# EAGLE design ReflowController (EAGLE 9.6.1)
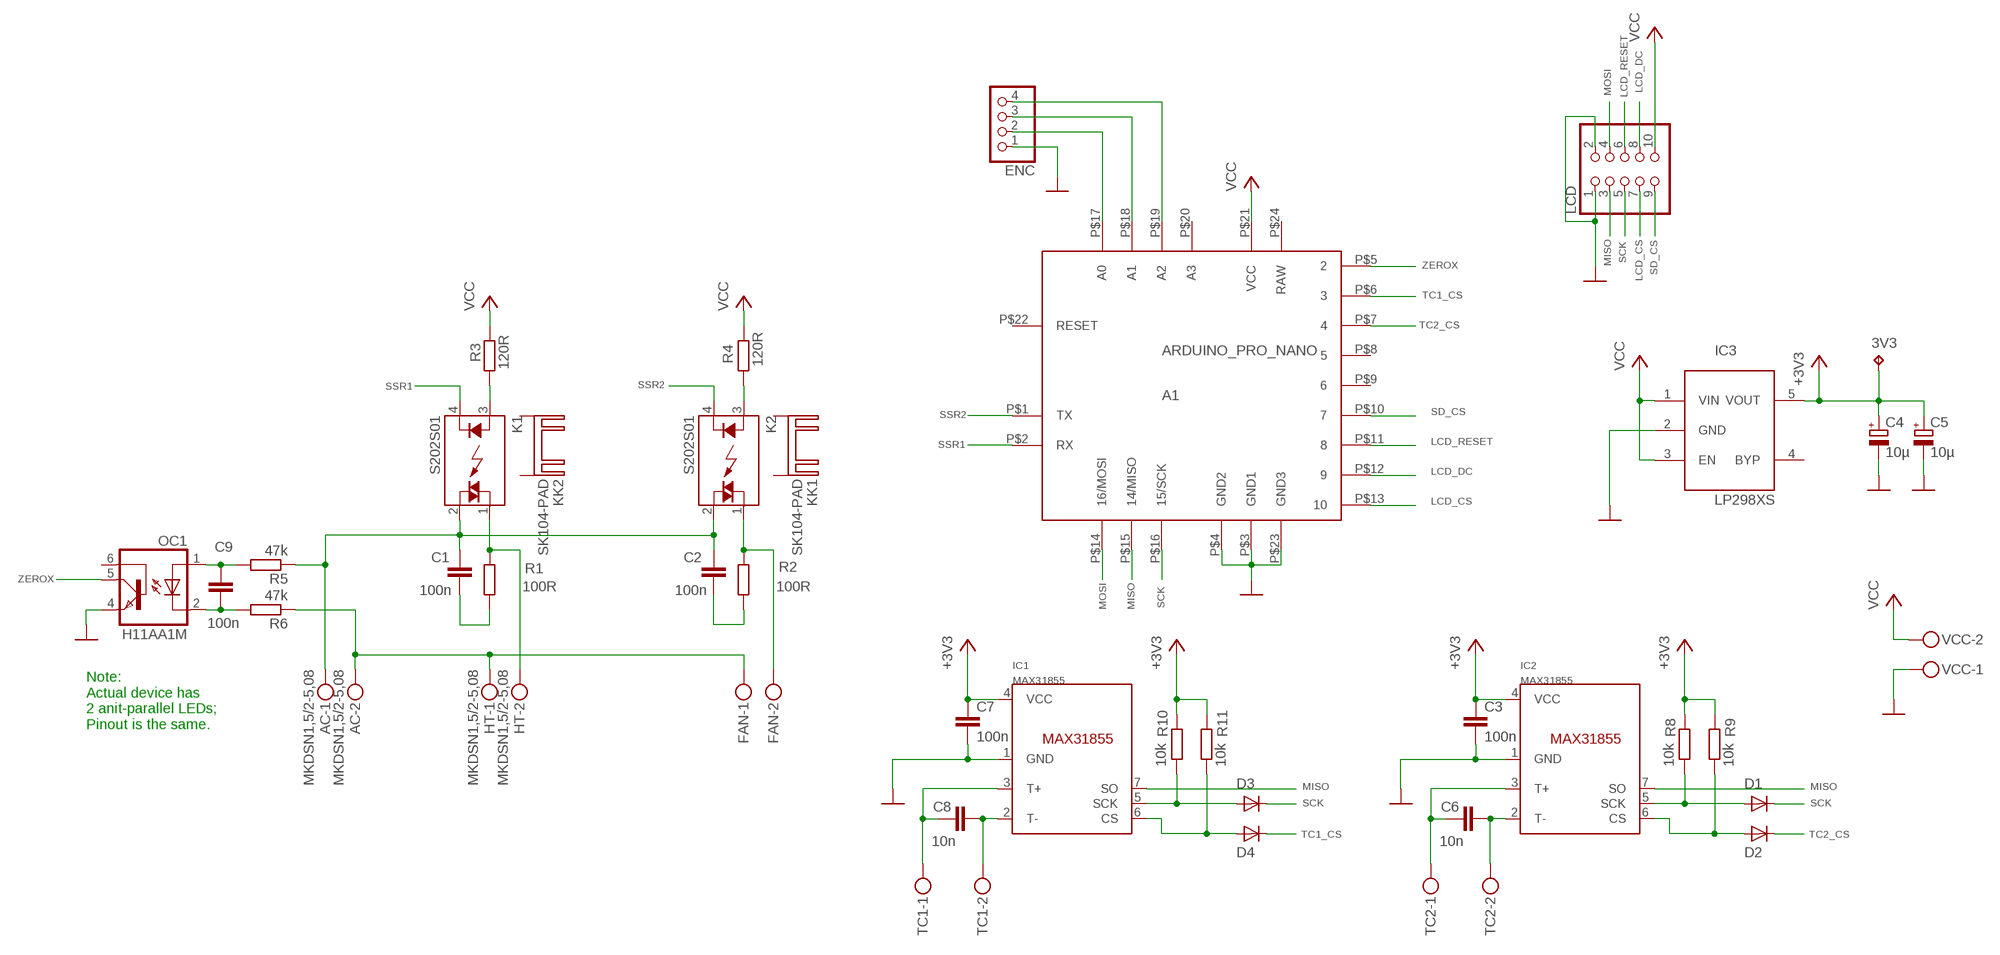
[diagram p0: schematic, sheet 1]

## Parts
3V3  TPTP08R  [TP08R]
A1  ARDUINO_PRO_NANO  [ARDUINO_PRO_NANO]
AC  MKDSN1,5/2-5,08  [MKDSN1,5/2-5,08]
C1  100n  CXXC10B5  [XC10B5]
C2  100n  CXXC10B5  [XC10B5]
C3  100n  C-EUC0805  [C0805]
C4  10µ  CPOL-EUC/6032-28R  [C/6032-28R]
C5  10µ  CPOL-EUC/6032-28R  [C/6032-28R]
C6  10n  C-EUC0603  [C0603]
C7  100n  C-EUC0805  [C0805]
C8  10n  C-EUC0603  [C0603]
C9  100n  C-EU025-025X050  [C025-025X050]
D1  DIODESOD-123  [SOD-123]
D2  DIODESOD-123  [SOD-123]
D3  DIODESOD-123  [SOD-123]
D4  DIODESOD-123  [SOD-123]
ENC  PINHD-1X4  [1X04]
FAN  MKDSN1,5/2-5,08  [MKDSN1,5/2-5,08]
HT  MKDSN1,5/2-5,08  [MKDSN1,5/2-5,08]
IC1  MAX31855  [SOIC8]
IC2  MAX31855  [SOIC8]
IC3  LP298XS  [SOT23-5L]
K1  S202S01  [S102S01]
K2  S202S01  [S102S01]
KK1  SK104-PAD  [SK104-PAD]
KK2  SK104-PAD  [SK104-PAD]
LCD  PINHD-2X5  [2X05]
OC1  H11AA1M  H11A1M  [DIL06]
R1  100R  R-EU_0207/5V  [0207/5V]
R2  100R  R-EU_0207/5V  [0207/5V]
R3  120R  R-EU_R0603  [R0603]
R4  120R  R-EU_R0603  [R0603]
R5  47k  R-EU_0207/5V  [0207/5V]
R6  47k  R-EU_0207/5V  [0207/5V]
R8  10k  R-EU_R0603  [R0603]
R9  10k  R-EU_R0603  [R0603]
R10  10k  R-EU_R0603  [R0603]
R11  10k  R-EU_R0603  [R0603]
TC1  MKDSN1,5/2-5,08  [MKDSN1,5/2-5,08]
TC2  MKDSN1,5/2-5,08  [MKDSN1,5/2-5,08]
VCC  MKDSN1,5/2-5,08  [MKDSN1,5/2-5,08]

## Nets
+3V3: 3V3.TP C3.1 C4.+ C5.+ C7.1 IC1.4(VCC) IC2.4(VCC) IC3.5(VOUT) R8.2 R9.2 R10.2 R11.2
AC1: AC.1 C1.1 C2.1 K1.2(DS2) K2.2(DS2) R5.1
AC2: AC.2 FAN.1 HT.1 R6.1
AC_OUT1: HT.2 K1.1(DS1) R1.2
AC_OUT2: FAN.2 K2.1(DS1) R2.2
GND: A1.P$3(GND1) A1.P$4(GND2) A1.P$23(GND3) C3.2 C4.- C5.- C7.2 ENC.1 IC1.1(GND) IC2.1(GND) IC3.2(GND) LCD.1 LCD.2 OC1.4(EMI) VCC.1
LCD_CS: A1.P$13 LCD.7
LCD_DC: A1.P$12 LCD.8
LCD_RESET: A1.P$11 LCD.6
MISO: A1.P$15(14/MISO) IC1.7(SO) IC2.7(SO) LCD.3
MOSI: A1.P$14(16/MOSI) LCD.4
N$1: C8.2 IC1.2(T-) TC1.2
N$2: C6.2 IC2.2(T-) TC2.2
N$3: C6.1 IC2.3(T+) TC2.1
N$4: A1.P$17(A0) ENC.2
N$5: A1.P$18(A1) ENC.3
N$6: C1.2 R1.1
N$7: C2.2 R2.1
N$8: A1.P$19(A2) ENC.4
N$9: C9.1 OC1.1(A) R5.2
N$10: C9.2 OC1.2(C) R6.2
N$11: C8.1 IC1.3(T+) TC1.1
N$13: K1.3(A) R3.2
N$14: K2.3(A) R4.2
N$15: D2.A IC2.6(CS) R9.1
N$16: D1.A IC2.5(SCK) R8.1
N$17: D4.A IC1.6(CS) R11.1
N$18: D3.A IC1.5(SCK) R10.1
SCK: A1.P$16(15/SCK) D1.C D3.C LCD.5
SD_CS: A1.P$10 LCD.9
SSR1: A1.P$2(RX) K1.4(K)
SSR2: A1.P$1(TX) K2.4(K)
TC1_CS: A1.P$6 D4.C
TC2_CS: A1.P$7 D2.C
VCC: A1.P$21(VCC) IC3.1(VIN) IC3.3(EN) LCD.10 R3.1 R4.1 VCC.2
ZEROX: A1.P$5 OC1.5(COL)
Unconnected: A1.P$8 A1.P$9 A1.P$20(A3) A1.P$22(RESET) IC3.4(BYP) KK1.K1(K) KK1.K2(K) KK2.K1(K) KK2.K2(K) OC1.6(BAS)

## Notes on the sheet
- Note:
  Actual device has 
  2 anit-parallel LEDs;
  Pinout is the same.

## Power pins joined to a net without a drawn wire
RAW: A1.P$24(RAW)

## Library data of the parts
3V3 = testpad:TP: Test pad
A1 = pit:ARDUINO_PRO_NANO: SparkFun Arduino Pro Nano
AC FAN HT TC1 TC2 VCC = con-phoenix-508:MKDSN1,5/2-5,08: MKDSN 1,5/ 2-5,08 Printklemme Nennstrom: 13,5 A Nennspannung: 250 V Rastermaß: 5,08 mm Polzahl: 2 Anschlussart: Schraubanschluss Montage: Löten Anschlussrichtung Leiter/Platine: 0 ° Artikelnummer: 1729128 Source: http://eshop.phoenixcontact.com .. 1729128.pdf; MPN: MKDSN 1,5/2-5.08; OC_FARNELL: 1792903; OC_NEWARK: 30M2397
C1 C2 = rcl:CX: X CAPACITOR for power line
C3 C6-C9 = rcl:C-EU: CAPACITOR, European symbol
C4 C5 = rcl:CPOL-EU: POLARIZED CAPACITOR, European symbol
D1-D4 = adafruit:DIODE: Diode SMADIODE - SMA Surface Mount Package 20V 1A Schottky Diode Digikey: 641-1014-6-ND DO-1N4148 - Through Hole Small Current Diode SOD-123 20V 1 A (.5mV Vf) Schottky Diode - Digikey: MBRX120TPMSCT-ND SOD-323 10V 570mA (.38mV Vf, 3ns) Schottky Diode - Digikey: ZLLS410CT-ND SOD-523 30V 30mA Schottky Diode (RB751S-40TE61) - Digikey: RB751S-40TE61CT-ND SOT23-R/W - SOT23 Package (R = Solder Paste/Reflow Ovens, W = Hand-Soldering) BAT54Film 40V 300mA - Digikey: 497-7162-1-ND
ENC = pinhead:PINHD-1X4: PIN HEADER
IC1 IC2 = AlexW-Eagle-Libraries:MAX31855
IC3 = adafruit:LP298X
K1 K2 = relay:S?*: Low Height Type Solid State Relays SHARP Source: 162574-da-01-en-S202T02_Solid_State_Relais.pdf Source: http://sharp-world.com .. s102s11_e.pdf; MPN: S202S01F; OC_FARNELL: 1618474; OC_NEWARK: 14N9587
KK1 KK2 = heatsink:SK104-PAD: HEATSINK manufacturer Fischer/distributor Buerklin
LCD = pinhead:PINHD-2X5: PIN HEADER
OC1 = optocoupler:H11A*?M: General Purpose 6-Pin Phototransistor Optocouplers Source: http://www.fairchildsemi.com/ds/4N/4N35-M.pdf; MPN: H11A1-M; OC_FARNELL: 1021358; OC_NEWARK: 97K1793
R1-R6 R8-R11 = rcl:R-EU_: RESISTOR, European symbol

## Board
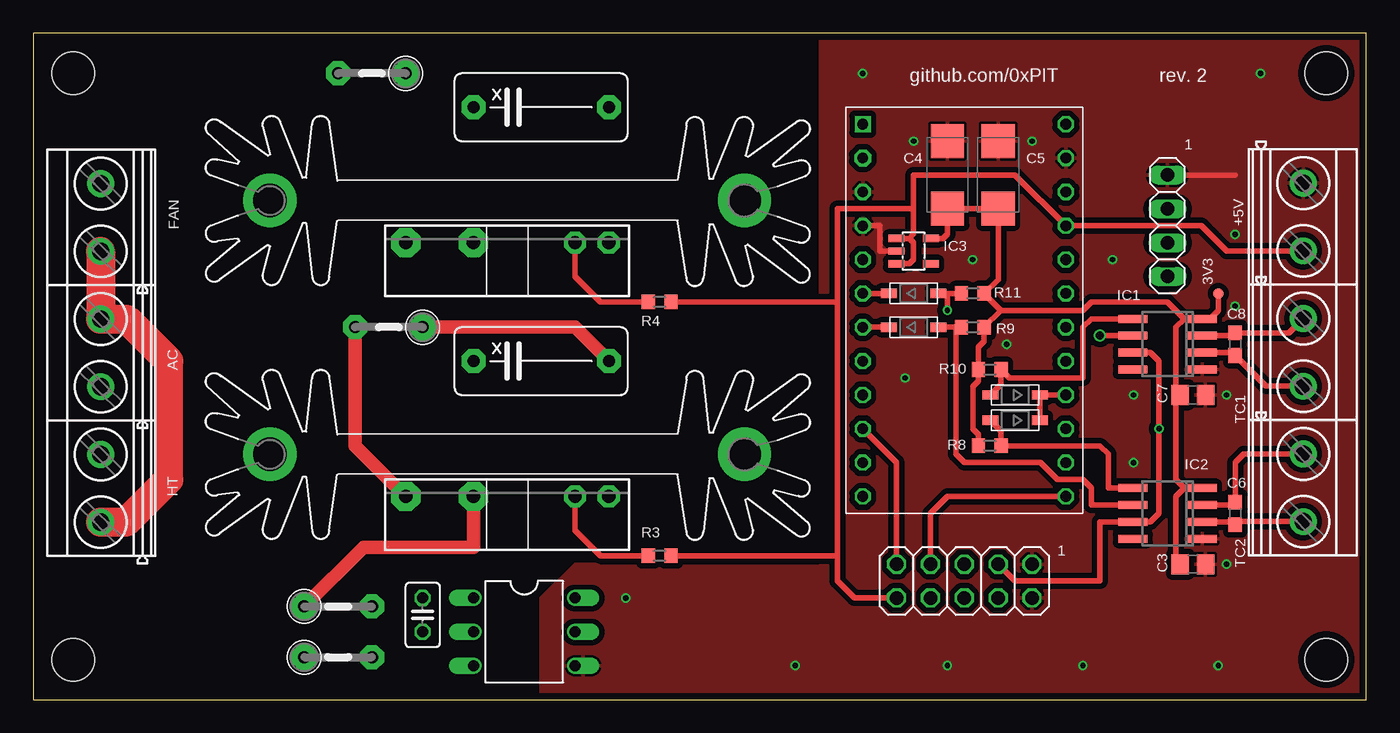
[diagram p1: board, top side]
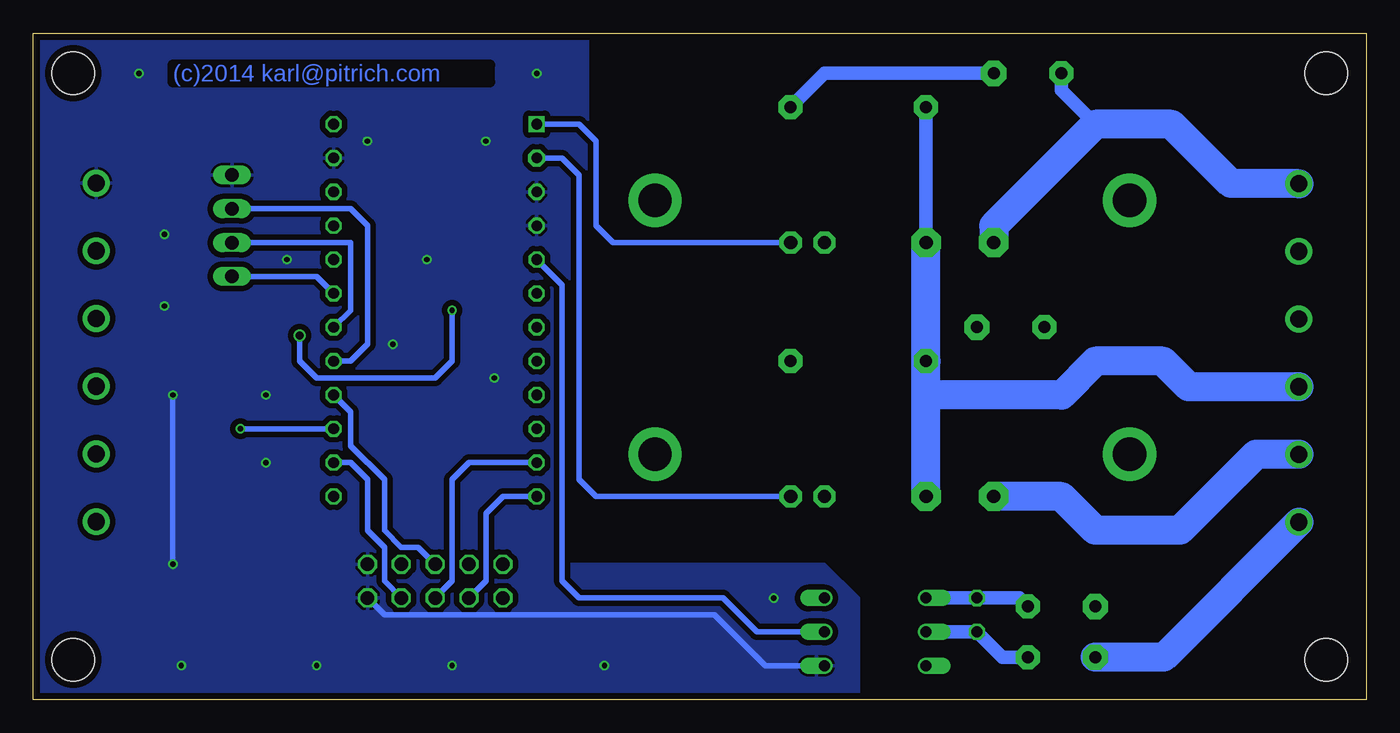
[diagram p2: board, bottom side, seen from below]

Size 100 x 50 mm. Coordinates in mm from the lower left corner, seen from the top.
Outline: 0,0 100,0 100,50 0,50 0,0
Copper layers (1*16): Top 0.035mm / dielectric 1.5mm / Bottom 0.035mm
Design rules "multi-cb_035um-cu_en *": minimum track width 6mil, minimum drill 12mil, track to track 6mil, track to pad 6mil, pad to pad 6mil, via to via 6mil, smd to smd 6mil, copper to edge 20mil, drill to drill 8mil, minimum pad ring 8mil, minimum via ring 6mil, stop-mask expansion 3mil, vias tented up to drill 0mil, thermal gap 8mil
Holes 3.2 mm at 3,3 97,3 3,47 97,47

### Footprints (pad centres in the part's own frame; a part is rotated, then mirrored left to right if it is on the bottom)
TP08R = smd 0.8 x 0.8: TP 0,0
ARDUINO_PRO_NANO = drill 0.8 square: P$1 -7.62,13.97 | drill 0.8 pad 1.27 octagon: P$2 -7.62,11.43 | drill 0.8 octagon: P$3 -7.62,8.89; P$4 -7.62,6.35; P$5 -7.62,3.81; P$6 -7.62,1.27; P$7 -7.62,-1.27; P$8 -7.62,-3.81; P$9 -7.62,-6.35; P$10 -7.62,-8.89; P$11 -7.62,-11.43; P$12 -7.62,-13.97; P$13 7.62,-13.97; P$14 7.62,-11.43; P$15 7.62,-8.89; P$16 7.62,-6.35; P$17 7.62,-3.81; P$18 7.62,-1.27; P$19 7.62,1.27; P$20 7.62,3.81; P$21 7.62,6.35; P$22 7.62,8.89; P$23 7.62,11.43; P$24 7.62,13.97
MKDSN1,5/2-5,08 = drill 1.3 pad 2: 1 -2.561,0.025; 2 2.519,0.025
XC10B5 = drill 0.9 pad 1.8 octagon: 1 -5.08,0; 2 5.08,0
C0805 = smd 1.3 x 1.5: 1 -0.95,0; 2 0.95,0
C/6032-28R = smd 2.55 x 2.5: + 2.525,0; - -2.525,0
C0603 = smd 1.1 x 1: 1 -0.85,0; 2 0.85,0
C025-025X050 = drill 0.813 octagon: 1 -1.27,0; 2 1.27,0
SOD-123 = smd 1.2 x 0.7: A 1.85,0; C -1.85,0
1X04 = drill 1.016 long: 1 -3.81,0; 2 -1.27,0; 3 1.27,0; 4 3.81,0
SOIC8 = smd 0.6 x 2.2: 1 -1.905,-2.6; 2 -0.635,-2.6; 3 0.635,-2.6; 4 1.905,-2.6; 5 1.905,2.6; 6 0.635,2.6; 7 -0.635,2.6; 8 -1.905,2.6
SOT23-5L = smd 0.55 x 1.2: 1 -0.95,-1.3; 2 0,-1.3; 3 0.95,-1.3; 4 0.95,1.3; 5 -0.95,1.3
S102S01 = drill 1 pad 2.2 octagon: 1 -7.62,0; 2 -2.54,0 | drill 1 pad 1.676 octagon: 3 5.08,0; 4 7.62,0
SK104-PAD = drill 2.5 pad 4: K1 -17.8,0; K2 17.8,0
2X05 = drill 1.016 octagon: 1 -5.08,-1.27; 2 -5.08,1.27; 3 -2.54,-1.27; 4 -2.54,1.27; 5 0,-1.27; 6 0,1.27; 7 2.54,-1.27; 8 2.54,1.27; 9 5.08,-1.27; 10 5.08,1.27
DIL06 = drill 0.813 offset: 1 -2.54,-3.81; 2 0,-3.81; 3 2.54,-3.81; 4 2.54,3.81; 5 0,3.81; 6 -2.54,3.81
0207/5V = drill 0.9 pad 1.9 octagon: 1 -2.54,0 | drill 0.9 pad 1.8 octagon: 2 2.54,0
R0603 = smd 1 x 1.1: 1 -0.85,0; 2 0.85,0

### Placement (x,y rotation side)
3V3  88.9,30.48 0 top
A1  69.85,29.21 0 top
AC  5.08,26.04 90 top
C1  38.1,25.4 0 top
C2  38.1,44.45 0 top
C3  87,10.16 0 top
C4  68.58,39.37 270 top
C5  72.39,39.37 270 top
C6  90.17,13.97 270 top
C7  87,22.86 0 top
C8  90.17,26.67 270 top
C9  29.21,6.35 270 top
D1  73.66,20.95 180 top
D2  66.04,27.94 0 top
D3  73.66,22.86 180 top
D4  66.04,30.48 0 top
ENC  85.09,35.56 270 top
FAN  5.08,36.2 90 top
HT  5.08,15.88 90 top
IC1  85.09,26.67 90 top
IC2  85.09,13.97 90 top
IC3  66.04,33.66 270 top
K1  35.56,15.24 0 top
K2  35.56,34.29 0 top
KK1  35.56,18.41 0 top
KK2  35.56,37.47 0 top
LCD  69.85,8.89 180 top
OC1  36.83,5.08 270 top
R1  26.67,27.94 180 top
R2  25.4,46.99 180 top
R3  46.99,10.79 180 top
R4  46.99,29.84 180 top
R5  22.86,6.99 0 top
R6  22.86,3.17 0 top
R8  71.75,19.05 180 top
R9  70.48,27.94 0 top
R10  71.75,24.77 180 top
R11  70.48,30.48 0 top
TC1  95.25,26.04 270 top
TC2  95.25,15.88 270 top
VCC  95.25,36.2 270 top

### Tracks (layer width: path | path; a pad name or v marks a point on that pad's centre or on a via)
+3V3
  Top 0.406: 86.36,28.57 IC1.4 87.63,28.64 88.33,28.64 88.9,29.21 3V3.TP | 86.36,28.57 85.72,27.94 85.72,22.86 | 85.72,22.86 85.72,16.51 86.36,15.88 | 86.36,15.88 IC2.4 | 86.36,15.88 85.72,15.24 85.72,10.47 C3.1 | C7.1 85.72,22.86 | 86.36,28.57 85.09,29.84 79.38,29.84 78.74,29.21 72.61,29.21 | IC3.5 68.26,34.6 68.58,34.92 C4.+ C5.+ 72.39,31.54 R11.2 72.61,29.21 | R8.2 70.91,19.9 70.48,20.32 70.48,23.5 70.91,23.91 R10.2 70.91,26.45 71.33,26.89 R9.2 72.61,29.21
AC1
  Top 1.016: R5.1 24.77,11.43 33.02,11.43 K1.2
  Bottom 1.016: C2.1 K2.2
  Bottom 2.184: K1.2 33.02,22.84 | 33.02,22.84 C1.1 K2.2 | AC.1 13.31,23.47 15.24,25.4 20.32,25.4 22.84,22.84 33.02,22.84
AC2
  Top 2.184: FAN.1 AC.2 7.01,28.55 10.16,25.4 10.16,16.51 6.96,13.31 HT.1
  Bottom 2.184: HT.1 15.19,3.17 R6.1
AC_OUT1
  Top 1.016: R1.2 24.13,19.05 K1.1
  Bottom 2.184: HT.2 8.28,18.39 13.97,12.7 20.32,12.7 22.86,15.24 K1.1
AC_OUT2
  Bottom 1.016: R2.2 22.86,45.72 20.32,43.18
  Bottom 2.184: FAN.2 10.16,38.73 14.6,43.18 20.32,43.18 27.94,35.56 K2.1
GND  (via drill 0.4 pad 0.61)
  Top 0.406: ENC.1 90.17,39.37 | IC3.2 63.5,33.66 63.5,35.56 A1.P$4
  Bottom 0.406: v89.53,10.16 v89.53,22.86 | LCD.2 73.66,6.35 48.9,6.35 45.09,2.54 OC1.4
  other vias: 66.04,41.91 74.93,41.91 70.48,33.02 90.17,29.53 90.17,34.92 80.96,33.02 82.55,17.78 82.55,22.86 73.03,26.67 44.45,7.62 57.15,2.54 68.58,2.54 78.74,2.54 88.9,2.54 92.08,46.99 62.23,46.99 65.41,24.13
  pour Bottom (isolate 0.406): 58.42,50.8 58.42,0 100.33,0 100.33,50.8
  pour Top (isolate 0.406): 59.05,50.8 59.05,0 100.33,0 100.33,50.8
  pour Bottom (isolate 0.406): 38.1,0 38.1,7.62 40.64,10.16 60.96,10.16 60.96,0
  pour Top (isolate 0.406): 38.1,0 38.1,7.62 40.64,10.16 60.96,10.16 60.96,0
LCD_CS
  Top 0.406: A1.P$13 68.58,15.24 67.31,13.97 LCD.7
LCD_DC
  Bottom 0.406: LCD.8 66.04,8.89 66.04,13.97 64.77,15.24 A1.P$12
LCD_RESET
  Bottom 0.406: A1.P$11 67.31,17.78 68.58,16.51 68.58,8.89 LCD.6
MISO  (via drill 0.4 pad 0.61)
  Top 0.406: IC1.7 83.82,26.04 84.45,25.4 v84.45,20.32 84.45,13.97 83.82,13.34 IC2.7 80.01,13.34 80.01,8.89 73.66,8.89 LCD.3
  Bottom 0.406: A1.P$15 v84.45,20.32
MOSI
  Bottom 0.406: A1.P$14 76.2,17.78 74.93,16.51 74.93,12.7 73.66,11.43 73.66,8.89 LCD.4
N$1
  Top 0.406: IC1.2 89.95,26.04 C8.2 92.47,23.52 TC1.2
N$2
  Top 0.406: IC2.2 89.95,13.34 C6.2 90.41,13.36 TC2.2
N$3
  Top 0.406: IC2.3 89.95,14.61 C6.1 90.17,17.78 90.83,18.44 TC2.1
N$4
  Bottom 0.406: A1.P$17 76.2,25.4 74.93,26.67 74.93,35.56 76.2,36.83 ENC.2
N$5
  Bottom 0.406: A1.P$18 76.2,29.21 76.2,34.29 ENC.3
N$6
  Top 1.016: R1.1 40.64,27.94 C1.2
N$7
  Bottom 1.016: R2.1 40.64,46.99 C2.2
N$8
  Bottom 0.406: ENC.4 78.74,31.75 A1.P$19
N$9
  Bottom 1.016: OC1.1 C9.1 26.04,7.62 R5.2
N$10
  Bottom 1.016: OC1.2 C9.2 27.3,3.17 R6.2
N$11
  Top 0.406: IC1.3 89.95,27.3 C8.1 94.2,27.52 TC1.1
N$13
  Top 0.406: R3.2 42.55,10.79 40.64,12.7 K1.3
N$14
  Top 0.406: R4.2 42.55,29.84 40.64,31.75 K2.3
N$15
  Top 0.406: IC2.6 79.38,14.61 79.38,15.88 78.74,16.51 76.83,16.51 75.56,17.78 69.85,17.78 69.22,18.41 69.22,27.94 | R9.1 69.22,27.94 | 69.22,27.94 D2.A
N$16
  Top 0.406: 82.55,15.94 IC2.5 80.64,15.88 80.64,18.41 80.01,19.05 R8.1 72.61,20.16 D1.A
N$17  (via drill 0.4 pad 0.61, 0.6)
  Top 0.406: IC1.6 v80.01,27.3 | D4.A 68.58,30.48 | 68.58,30.48 R11.1 | v68.58,29.21 68.58,30.48
  Bottom 0.406: v80.01,27.3 80.01,25.4 78.74,24.13 69.85,24.13 68.58,25.4 v68.58,29.21
N$18
  Top 0.406: D3.A 72.61,23.66 R10.1 73.24,24.13 78.74,24.13 78.74,27.94 79.38,28.57 IC1.5
SCK
  Top 0.406: A1.P$16 D3.C D1.C
  Bottom 0.406: LCD.5 71.12,11.43 72.39,11.43 73.66,12.7 73.66,16.51 76.2,19.05 76.2,21.59 A1.P$16
SD_CS
  Top 0.406: LCD.9 64.77,17.78 A1.P$10
SSR1
  Bottom 0.406: K1.4 57.78,15.24 59.05,16.51 59.05,39.37 60.33,40.64 A1.P$2
SSR2
  Bottom 0.406: K2.4 56.52,34.29 57.78,35.56 57.78,41.91 59.05,43.18 A1.P$1
TC1_CS
  Top 0.406: D4.C A1.P$6
TC2_CS
  Top 0.406: D2.C A1.P$7
VCC
  Top 0.406: 60.33,10.79 60.33,8.89 61.59,7.62 LCD.10 | 60.33,10.79 60.33,29.84 | 60.33,29.84 60.33,36.83 66.04,36.83 | IC3.3 65.72,32.7 66.04,33.02 66.04,34.29 65.72,34.6 IC3.1 65.72,34.6 66.04,34.92 66.04,36.83 | 66.04,36.83 66.04,39.37 73.66,39.37 A1.P$21 87.63,35.56 89.53,33.66 95.25,33.66 VCC.2 | R4.1 60.33,29.84 | R3.1 60.33,10.79
ZEROX
  Bottom 0.406: OC1.5 45.72,5.08 48.26,7.62 59.05,7.62 60.33,8.89 60.33,31.11 A1.P$5

### Text on the board
Bottom: (c)2014 karl@pitrich.com
tPlace: github.com/0xPIT | rev. 2
tNames: 1 | +5V | 1